# Altium schematic sheet [00] - BLOCK DIAGRAM.SchDoc: Desk Digital Clock
size A4; DrawnBy: Ramil Teregulov; Address1: https://github.com/teregulov; Address2: https://github.com/teregulov/Desk-Digital-Clock; DocumentNumber: DDC-1; Revision: 1R0; SheetNumber: 1; SheetTotal: 7
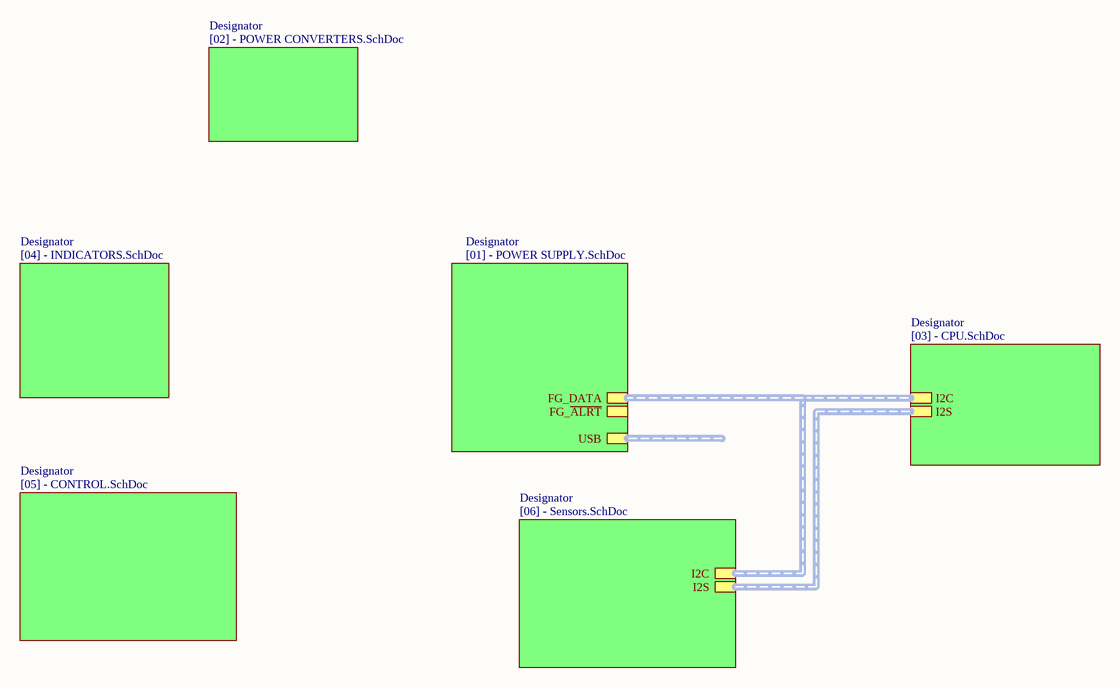
[diagram p0: [00] - BLOCK DIAGRAM.SchDoc]

## Sub-sheets
Designator = [01] - POWER SUPPLY.SchDoc: FG_DATA, FG_~{ALRT}, USB
Designator = [02] - POWER CONVERTERS.SchDoc: no entries
Designator = [03] - CPU.SchDoc: I2C, I2S
Designator = [04] - INDICATORS.SchDoc: no entries
Designator = [05] - CONTROL.SchDoc: no entries
Designator = [06] - Sensors.SchDoc: I2C, I2S

## Buses and harness runs
harness sheet Designator/FG_DATA = sheet Designator/I2C

## Notes on the sheet
- Title:
- Size:
- Date:
- A4
- Number:
- Time:
- Revision:
- Sheet
- of
- File: